# EAGLE board Arduino-M0-Pro-V4 (EAGLE 6.4)
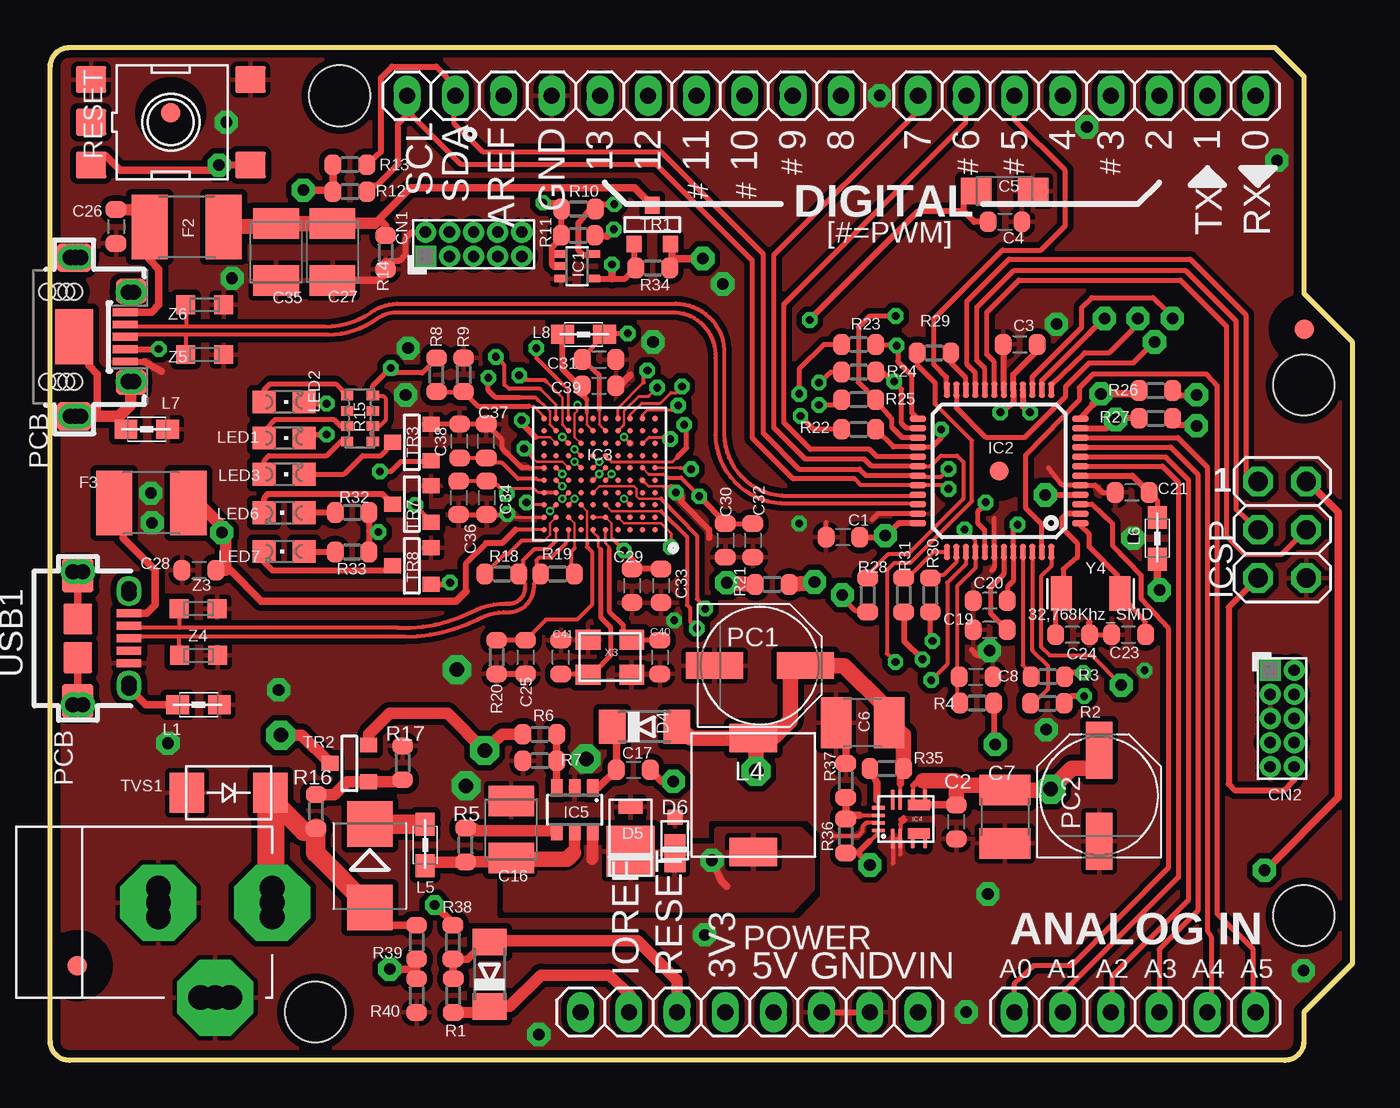
[diagram p3: board, top side]
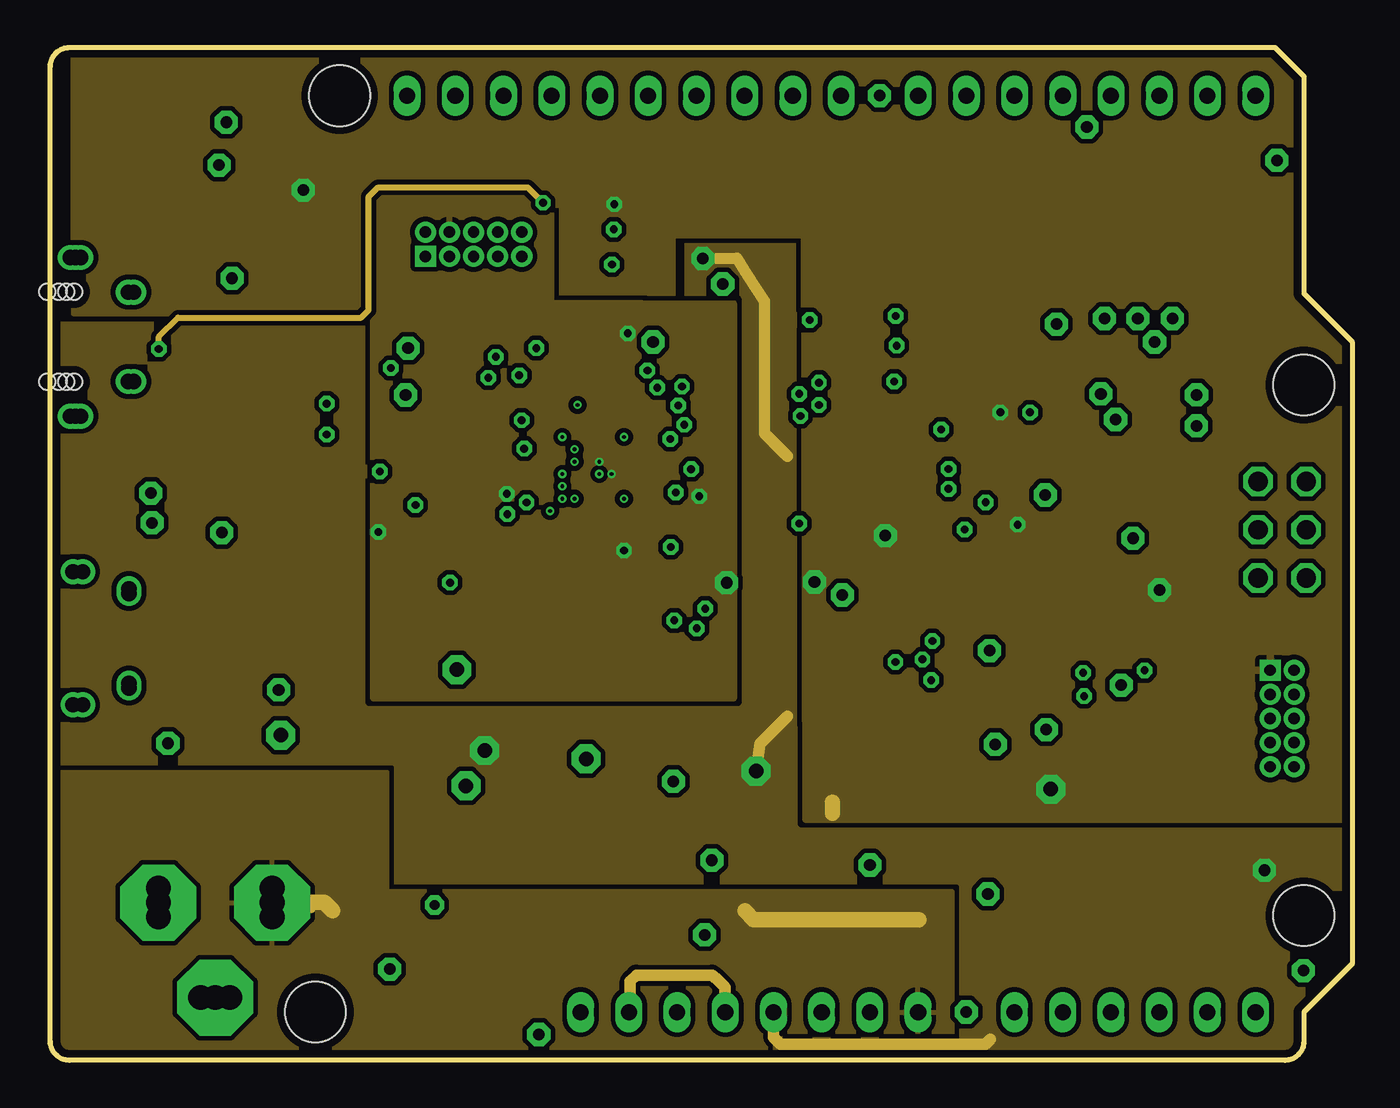
[diagram p4: board, inner layer Route2]
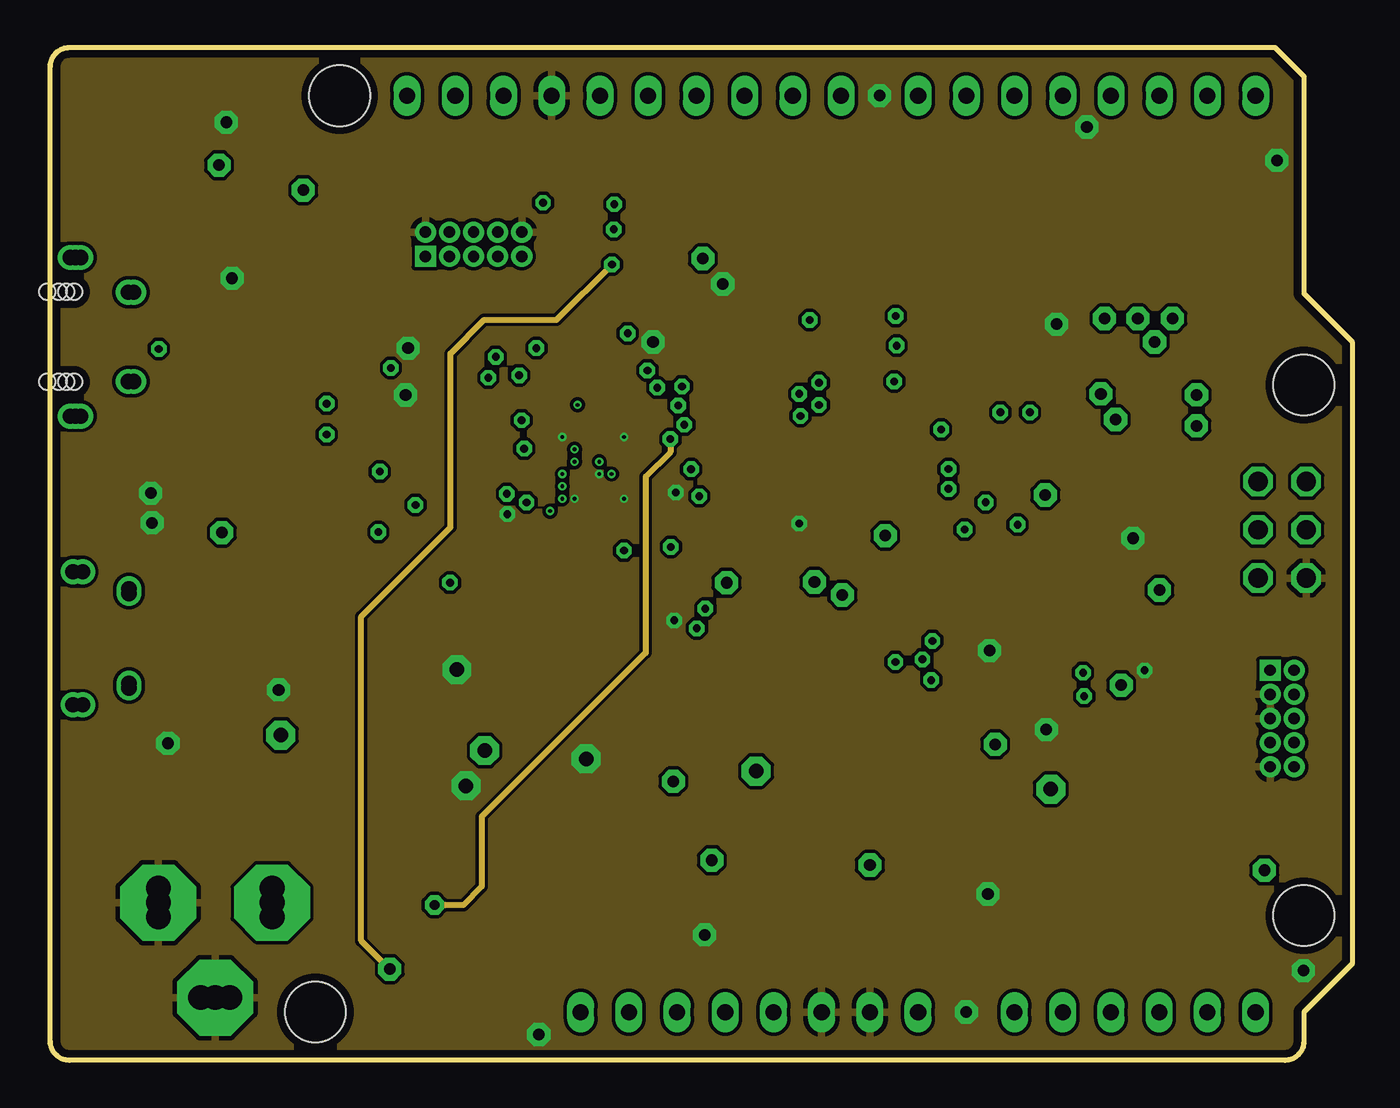
[diagram p5: board, inner layer Route15]
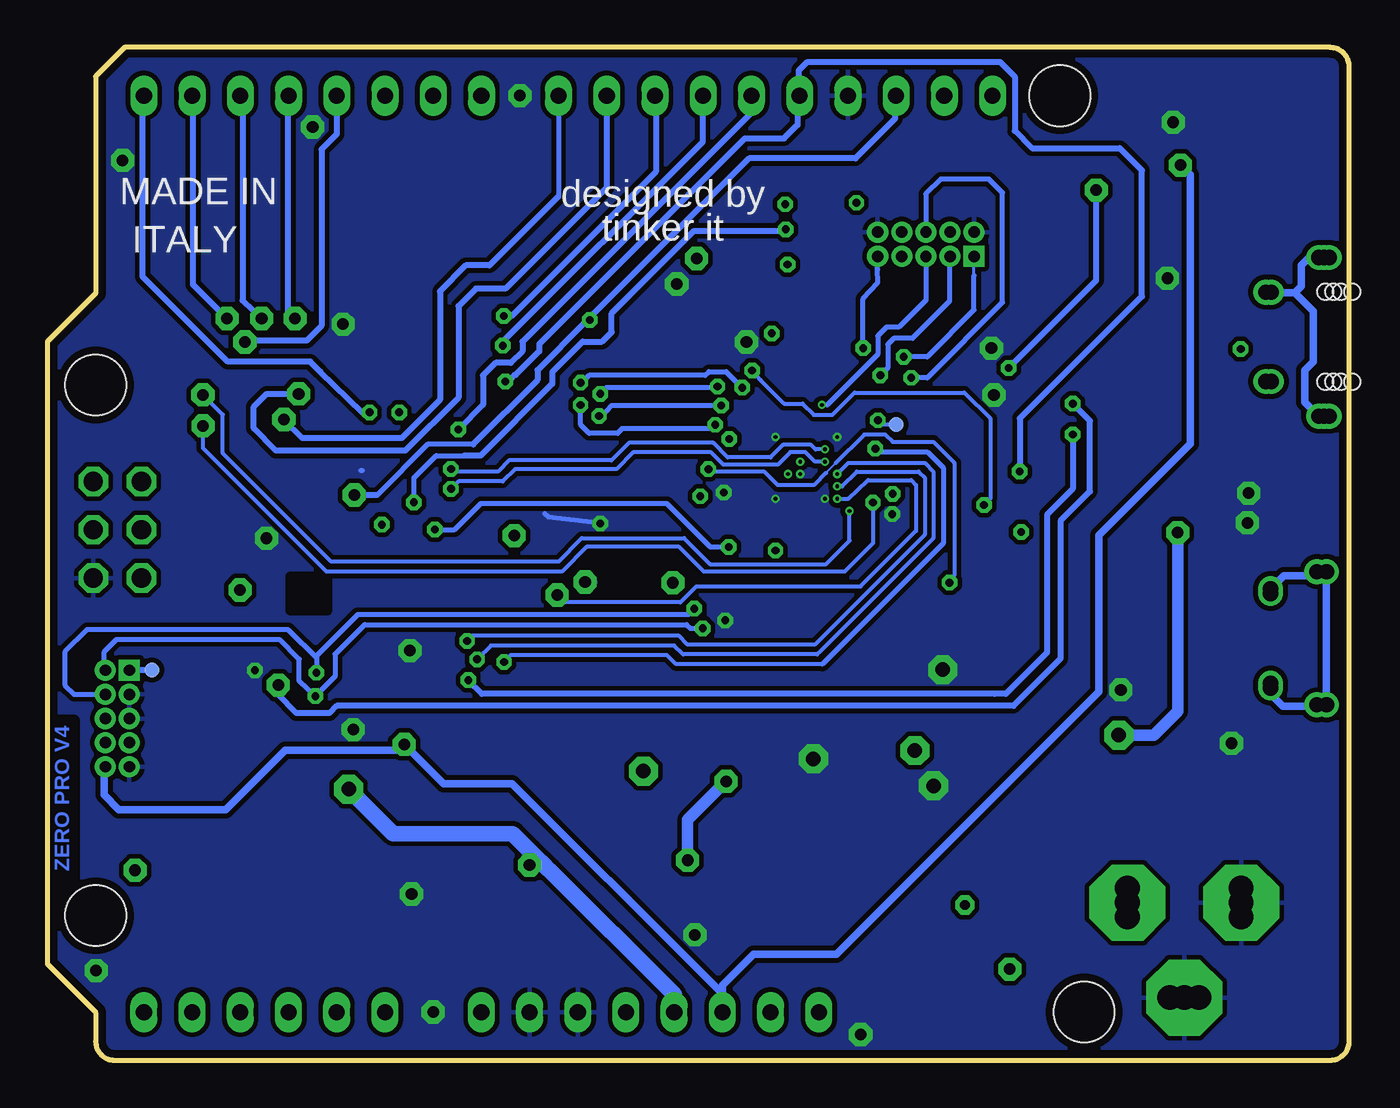
[diagram p6: board, bottom side, seen from below]

Size 68.58 x 53.34 mm. Coordinates in mm from the lower left corner, seen from the top.
Outline: 64.52,53.34 66.04,51.82 66.04,40.39 68.58,37.85 68.58,5.08 66.04,2.54 66.04,1 arc-90 65.04,0 1,0 arc-90 0,1 0,52.34 arc-90 1,53.34 64.52,53.34
Copper layers (1*2+15*16): Top 0.035mm / dielectric 0.5mm / Route2 0.035mm / dielectric 0.4mm / Route15 0.035mm / dielectric 0.5mm / Bottom 0.035mm
Design rules "ArduinoUno *": minimum track width 6mil, minimum drill 16mil, track to track 6mil, track to pad 6mil, pad to pad 6mil, via to via 6mil, smd to smd 4mil, copper to edge 16mil, drill to drill 10mil, minimum pad ring 10mil, minimum via ring 4.5mil, stop-mask expansion 1mil, vias tented up to drill 30mil, thermal gap 10mil
Net classes: 0 default: width 0.203 mm, drill 0.203 mm, clearance 0.178 mm; 1 USB: width 0.203 mm, drill 0.305 mm, clearance 0.178 mm; 2 gnd: width 0.254 mm, drill 0.254 mm, clearance 0.178 mm; 3 usbvcc: width 0.203 mm, drill 0.406 mm, clearance 0.178 mm; 4 USBpair: width 0.254 mm, drill 0.406 mm, clearance 0.508 mm to class 0, clearance 0.508 mm to class 1, clearance 0.508 mm to class 2, clearance 0.508 mm to class 3
Holes 3.2 mm at 66.04,35.56 66.04,7.62 15.24,50.8 13.97,2.54
bKeepout: area -0.1,3.2 to 1.9,11
bRestrict: 2 lines
vRestrict: area 22.9,44.1 to 24.6,49.1; area 25.4,45.5 to 27.1,49.1; area 28.4,45.3 to 29.6,48.8; area 31,45.3 to 32.1,48.8; area 33.5,45.3 to 34.7,48.8; area 36.1,45.3 to 37.2,48.8; area 38.7,47.2 to 39.9,48.8; area 40.3,45.1 to 47.6,46.9; area 60.3,44.2 to 61.7,46.7; area 62.9,44.2 to 64.3,46.7; area 61.3,35.8 to 64.8,37.2; area 0.6,21.8 to 2,30.1; area 5.7,22.6 to 7.4,30.1; area 47.9,10.3 to 48.5,10.8; area 50.4,10.2 to 50.9,11; area 11.3,28.8 to 12.7,31.1; area 44.8,47.5 to 46.1,48.9; area 47.6,47.4 to 48.8,48.9; area 50.2,47.4 to 51.3,48.9; area 52.8,47.4 to 54,48.9; area 55.2,47.4 to 56.4,48.9; area 57.9,47.4 to 59.1,48.9; area 60.5,47.4 to 61.6,48.9; area 63,47.4 to 64.1,48.9; area 41.3,47.2 to 42.4,48.8; area 0.3,12.4 to 9.4,24.5

## Footprints (pad centres in the part's own frame; a part is rotated, then mirrored left to right if it is on the bottom)
1X06 = drill 0.85 pad 1.422 long: 1 -6.35,0; 2 -3.81,0; 3 -1.27,0; 4 1.27,0; 5 3.81,0; 6 6.35,0
C0603-ROUND = smd 0.898 x 1.1: 1 -0.889,0; 2 0.889,0
SMC_A = smd 1.6 x 1.4: + -1.5,0; - 1.5,0
C1210 = smd 1.6 x 2.7: 1 -1.4,0; 2 1.4,0
SMC_B = smd 1.6 x 2.4: + -1.5,0; - 1.5,0
PINHEAD_2X05_127 = drill 0.6 pad 1.016 square: 1 -0.635,2.54 | drill 0.6 pad 1.016: 2 0.635,2.54; 3 -0.635,1.27; 4 0.635,1.27; 5 -0.635,0; 6 0.635,0; 7 -0.635,-1.27; 8 0.635,-1.27; 9 -0.635,-2.54; 10 0.635,-2.54
SMB = smd 2.4 x 2.4: A 2.2,0; C -2.2,0
MINIMELF = smd 1.4 x 1.8: A 1.7,0; C -1.7,0
DO220AAL = smd 2.667 x 2.54: P$1 -0.7,0 | smd 0.762 x 1.27: P$2 1.65,0
MICROSMP = smd 0.8 x 0.8: A 1.2,0 | smd 2 x 1.1: K -0.7,0
L1812 = smd 1.9 x 3.4: 1 -1.95,0; 2 1.95,0
FIDUCIA-MOUNT = smd 1.016 x 1.016: P$1 0,0
SC70-5 = smd 0.4 x 0.7: 1 -0.65,-0.85; 2 0,-0.85; 3 0.65,-0.85; 4 0.65,0.85; 5 -0.65,0.85
TQFP48-7X7 = smd 0.85 x 0.32: 1 -4.275,2.75; 2 -4.275,2.25; 3 -4.275,1.75; 4 -4.275,1.25; 5 -4.275,0.75; 6 -4.275,0.25; 7 -4.275,-0.25; 8 -4.275,-0.75; 9 -4.275,-1.25; 10 -4.275,-1.75; 11 -4.275,-2.25; 12 -4.275,-2.75; 25 4.275,-2.75; 26 4.275,-2.25; 27 4.275,-1.75; 28 4.275,-1.25; 29 4.275,-0.75; 30 4.275,-0.25; 31 4.275,0.25; 32 4.275,0.75; 33 4.275,1.25; 34 4.275,1.75; 35 4.275,2.25; 36 4.275,2.75 | smd 0.32 x 0.85: 13 -2.75,-4.275; 14 -2.25,-4.275; 15 -1.75,-4.275; 16 -1.25,-4.275; 17 -0.75,-4.275; 18 -0.25,-4.275; 19 0.25,-4.275; 20 0.75,-4.275; 21 1.25,-4.275; 22 1.75,-4.275; 23 2.25,-4.275; 24 2.75,-4.275; 37 2.75,4.275; 38 2.25,4.275; 39 1.75,4.275; 40 1.25,4.275; 41 0.75,4.275; 42 0.25,4.275; 43 -0.25,4.275; 44 -0.75,4.275; 45 -1.25,4.275; 46 -1.75,4.275; 47 -2.25,4.275; 48 -2.75,4.275 | smd 1 x 1: P$1 0,0
VFBGA100 = smd 0.28 x 0.28: A1 -2.925,2.925; A2 -2.275,2.925; A3 -1.625,2.925; A4 -0.975,2.925; A5 -0.325,2.925; A6 0.325,2.925; A7 0.975,2.925; A8 1.625,2.925; A9 2.275,2.925; A10 2.925,2.925; B1 -2.925,2.275; B2 -2.275,2.275; B3 -1.625,2.275; B4 -0.975,2.275; B5 -0.325,2.275; B6 0.325,2.275; B7 0.975,2.275; B8 1.625,2.275; B9 2.275,2.275; B10 2.925,2.275; C1 -2.925,1.625; C2 -2.275,1.625; C3 -1.625,1.625; C4 -0.975,1.625; C5 -0.325,1.625; C6 0.325,1.625; C7 0.975,1.625; C8 1.625,1.625; C9 2.275,1.625; C10 2.925,1.625; D1 -2.925,0.975; D2 -2.275,0.975; D3 -1.625,0.975; D4 -0.975,0.975; D5 -0.325,0.975; D6 0.325,0.975; D7 0.975,0.975; D8 1.625,0.975; D9 2.275,0.975; D10 2.925,0.975; E1 -2.925,0.325; E2 -2.275,0.325; E3 -1.625,0.325; E4 -0.975,0.325; E5 -0.325,0.325; E6 0.325,0.325; E7 0.975,0.325; E8 1.625,0.325; E9 2.275,0.325; E10 2.925,0.325; F1 -2.925,-0.325; F2 -2.275,-0.325; F3 -1.625,-0.325; F4 -0.975,-0.325; F5 -0.325,-0.325; F6 0.325,-0.325; F7 0.975,-0.325; F8 1.625,-0.325; F9 2.275,-0.325; F10 2.925,-0.325; G1 -2.925,-0.975; G2 -2.275,-0.975; G3 -1.625,-0.975; G4 -0.975,-0.975; G5 -0.325,-0.975; G6 0.325,-0.975; G7 0.975,-0.975; G8 1.625,-0.975; G9 2.275,-0.975; G10 2.925,-0.975; H1 -2.925,-1.625; H2 -2.275,-1.625; H3 -1.625,-1.625; H4 -0.975,-1.625; H5 -0.325,-1.625; H6 0.325,-1.625; H7 0.975,-1.625; H8 1.625,-1.625; H9 2.275,-1.625; H10 2.925,-1.625; J1 -2.925,-2.275; J2 -2.275,-2.275; J3 -1.625,-2.275; J4 -0.975,-2.275; J5 -0.325,-2.275; J6 0.325,-2.275; J7 0.975,-2.275; J8 1.625,-2.275; J9 2.275,-2.275; J10 2.925,-2.275; K1 -2.925,-2.925; K2 -2.275,-2.925; K3 -1.625,-2.925; K4 -0.975,-2.925; K5 -0.325,-2.925; K6 0.325,-2.925; K7 0.975,-2.925; K8 1.625,-2.925; K9 2.275,-2.925; K10 2.925,-2.925
QFN-12 = smd 1.05 x 0.2: 1 -1.025,0.7; 2 -1.025,0.3; 3 -1.025,-0.35; 4 -1.025,-1; 5 1.025,-1; 6 1.025,-0.35; 7 1.025,0.3; 8 1.025,0.7 | smd 0.2 x 0.7: 9 0.6,1.45; 10 0.2,1.45; 11 -0.2,1.45; 12 -0.6,1.45 | smd 0.55 x 1.2: 13 -0.75,-0.675; 14 0.75,-0.675
SOT23-6 = smd 0.6 x 0.9: 1 -0.95,-1.15; 2 0,-1.15; 3 0.95,-1.15; 4 0.95,1.15; 5 0,1.15; 6 -0.95,1.15
2X03 = drill 1.016 pad 1.55 octagon: 1 -2.54,-1.27; 2 -2.54,1.27; 3 0,-1.27; 4 0,1.27; 5 2.54,-1.27; 6 2.54,1.27
1X10 = drill 0.85 pad 1.422 long: 1 -11.43,0; 2 -8.89,0; 3 -6.35,0; 4 -3.81,0; 5 -1.27,0; 6 1.27,0; 7 3.81,0; 8 6.35,0; 9 8.89,0; 10 11.43,0
1X08 = drill 0.85 pad 1.422 long: 1 -8.89,0; 2 -6.35,0; 3 -3.81,0; 4 -1.27,0; 5 1.27,0; 6 3.81,0; 7 6.35,0; 8 8.89,0
0805 = smd 1.2 x 1: 1 -1.1,0; 2 1.1,0
SRR0604 = smd 1.5 x 2.5: P$1 3,0; P$2 -3,0
CHIPLED_0805 = smd 1.2 x 1.2: A 0,-1.05; C 0,1.05
PANASONIC_D = smd 3 x 1.4: + 2.4,0; - -2.4,0
R0603-ROUND = smd 0.898 x 1.1: 1 -0.889,0; 2 0.889,0
CAY16 = smd 0.5 x 0.65: 1 -1.2,-0.675; 2 -0.4,-0.675; 3 0.4,-0.675; 4 1.2,-0.675; 5 1.2,0.675; 6 0.4,0.675; 7 -0.4,0.675; 8 -1.2,0.675
TS42 = smd 1.6 x 1.4: 1 -4.2,2.25; 2 4.2,2.25; 3 -4.2,-2.25; 4 4.2,-2.25; 5 -4.2,0
TP-SP = smd 0.8 x 0.8 bottom: X 0,0
SOT-23 = smd 0.787 x 0.889: 1 0.025,-1.016; 2 -0.94,1.016; 3 0.991,1.016
SMA-TVS = smd 1.8 x 2.1: A -2.2,0; K 2.2,0
CON2_USB_MICRO_B_AT = smd 0.406 x 1.346: P1 -1.321,2.692; P2 -0.66,2.692; P3 0,2.692; P4 0.66,2.692; P5 1.321,2.692 | drill 0.8 pad 1.24: P$1 -2.616,2.692; P$2 -2.362,2.692; P$7 2.362,2.692; P$8 2.616,2.692 | drill 0.8 pad 1.25: P$3 -3.505,-0.254; P$4 -3.505,0.254; P$5 3.505,0.254; P$6 3.505,-0.254 | smd 1.778 x 1.651: S1 -3.302,0; S2 3.302,0 | smd 1.524 x 1.27: S3 -2.489,2.692; S4 2.489,2.692 | smd 1.626 x 1.524: S5 -1.016,0; S6 1.016,0
MCR-AB1-S-RA-SMT = smd 0.4 x 1.35: 1 -1.3,2.7; 2 -0.65,2.7; 3 0,2.7; 4 0.65,2.7; 5 1.3,2.7 | drill 0.8: P$1 -4.175,0.356; P$3 -4.175,0.076; P$4 -4.175,-0.203; P$5 4.175,0.356; P$6 4.175,0.076; P$7 4.175,-0.203 | smd 2.9 x 2: P$2 0,0 | drill 0.8 pad 1.27: P$8 -2.35,3.15; P$9 -2.35,2.85; P$10 2.35,3.15; P$11 2.35,2.85 | smd 1.3 x 1.6: S1 -2.4,3; S2 2.4,3 | smd 1.5 x 1.8: S3 -4.175,0; S4 4.175,0 | hole 0.85: -2.375,0; 2.375,0; -2.375,-1.4; 2.375,-1.4; -2.375,-0.4; 2.375,-0.4; 2.375,-0.8; -2.375,-0.8
POWERSUPPLY_DC-21MM = drill 1.3 pad 4 octagon: 1 -5.08,-3.353; 2 -0.076,-6.35; 3 -0.076,-0.356 | drill 1.3: 4 -5.08,-4.115; 5 -5.08,-2.591; 6 -0.838,-0.356; 7 0.686,-0.356; 8 -0.838,-6.35; 9 0.686,-6.35
CRYSTAL-3.2-2.5 = smd 1.3 x 1.05: 1 -1.15,-0.925; 2 1.15,-0.925; 3 1.15,0.925; 4 -1.15,0.925
RESONATOR_EPSON_FC_145 = smd 1.1 x 1.8: P$1 -1.55,0; P$2 1.55,0
CT/CN0603 = smd 1 x 1: 1 -1,0; 2 1,0

## Placement (x,y rotation side)
AD  FH254-106DF08500V  [1X06]  57.15,2.54 0 top
C1  100nF  [C0603-ROUND]  41.76,27.55 180 top
C2  100n  [C0603-ROUND]  47.73,12.55 90 top
C3  100nF  [C0603-ROUND]  51.09,37.7 0 top
C4  100nF  [C0603-ROUND]  50.3,44.16 0 top
C5  4u7  [SMC_A]  50.27,45.78 0 top
C6  10uF_35V  [C1210]  42.8,17.78 180 top
C7  10uF_35V  [C1210]  50.29,12.83 270 top
C8  10nF  [C0603-ROUND]  48.77,20.19 0 top
C16  22u  [SMC_B]  24.28,12.16 90 top
C17  10n  [C0603-ROUND]  30.71,15.3 0 top
C19  100nF  [C0603-ROUND]  49.51,22.67 180 top
C20  100nF  [C0603-ROUND]  49.51,24.2 180 top
C21  100nF  [C0603-ROUND]  56.99,29.91 180 top
C23  22p  [C0603-ROUND]  56.81,22.42 0 top
C24  22p  [C0603-ROUND]  53.85,22.41 180 top
C25  10pF  [C0603-ROUND]  25.04,21.23 270 top
C26  10n  [C0603-ROUND]  3.46,43.91 270 top
C27  22u  [SMC_B]  14.87,42.57 270 top
C28  100n  [C0603-ROUND]  7.83,25.81 180 top
C29  100nF  [C0603-ROUND]  30.65,24.99 270 top
C30  100nF  [C0603-ROUND]  35.56,27.38 270 top
C31  100nF  [C0603-ROUND]  28.91,36.9 0 top
C32  1uF  [C0603-ROUND]  37.01,27.38 270 top
C33  1uF  [C0603-ROUND]  32.17,24.99 270 top
C34  1uF  [C0603-ROUND]  22.98,29.62 270 top
C35  22u  [SMC_B]  11.9,42.56 270 top
C36  100nF  [C0603-ROUND]  21.51,29.62 270 top
C37  1nF  [C0603-ROUND]  22.97,32.61 90 top
C38  1uF  [C0603-ROUND]  21.56,32.61 90 top
C39  100nF  [C0603-ROUND]  28.91,35.52 0 top
C40  10pF  [C0603-ROUND]  32.11,21.23 270 top
C41  10pF  [C0603-ROUND]  26.9,21.23 90 top
CN1  PINHEAD-2x5-P1.27  [PINHEAD_2X05_127]  22.3,42.98 90 top
CN2  PINHEAD-2x5-P1.27  [PINHEAD_2X05_127]  64.9,18 0 top
D1  M7  [SMB]  16.83,10.24 270 top
D2  CD1206-S01575  [MINIMELF]  23.14,4.54 90 top
D4  CD1206-S01575  [MINIMELF]  31.31,17.57 0 top
D5  SS1P3L  [DO220AAL]  30.56,11.71 90 top
D6  MSS1P3L-M3/89A  [MICROSMP]  32.9,11.6 90 top
F2  MF-MSMF050-2 500mA  [L1812]  7.19,43.89 180 top
F3  MF-MSMF050-2 500mA  [L1812]  5.33,29.36 180 top
FD1  FIDUCIALMOUNT  [FIDUCIA-MOUNT]  6.35,49.91 0 top
FD2  FIDUCIALMOUNT  [FIDUCIA-MOUNT]  1.42,4.98 0 top
FD3  FIDUCIALMOUNT  [FIDUCIA-MOUNT]  66.06,38.51 0 top
IC1  74LVC1G125DCKR  [SC70-5]  27.76,41.82 270 top
IC2  SAMD21G18A-AUT  [TQFP48-7X7]  49.99,31.04 180 top
IC3  [VFBGA100]  28.93,30.88 180 top
IC4  MPM3810GQB-33  [QFN-12]  45.09,12.7 90 top
IC5  LM2734Y  [SOT23-6]  27.63,13.19 180 top
ICSP  3x2 M  [2X03]  64.9,27.94 270 top
IOH  FH254-110DF08500V  [1X10]  30.23,50.8 180 top
IOL  FH254-108DF08500V  [1X08]  54.61,50.8 180 top
L1  MH2029-300Y  [0805]  7.81,18.72 0 top
L4  10uH-SRR0604-100ML  [SRR0604]  37.03,13.97 270 top
L5  MH2029-300Y  [0805]  19.75,11.34 270 top
L6  MH2029-300Y  [0805]  58.32,27.48 270 top
L7  MH2029-300Y  [0805]  5.08,33.23 0 top
L8  MH2029-300Y  [0805]  28.09,38.23 180 top
LED1  Yellow  [CHIPLED_0805]  12.32,32.77 270 top
LED2  Yellow  [CHIPLED_0805]  12.32,34.67 270 top
LED3  Yellow  [CHIPLED_0805]  12.32,30.86 270 top
LED6  Green  [CHIPLED_0805]  12.32,28.83 90 top
LED7  Green  [CHIPLED_0805]  12.32,26.8 90 top
PC1  47u  [PANASONIC_D]  37.38,20.79 0 top
PC2  47u  [PANASONIC_D]  55.26,13.93 90 top
POWER  FH254-108DF08500V  [1X08]  36.83,2.54 0 top
R1  10k  [R0603-ROUND]  21.23,3.41 270 top
R2  0R  [R0603-ROUND]  52.53,18.8 180 top
R3  0R  [R0603-ROUND]  52.55,20.21 0 top
R4  330R  [R0603-ROUND]  48.81,18.81 0 top
R5  52K3  [R0603-ROUND]  21.87,11.34 90 top
R6  52K3  [R0603-ROUND]  25.79,17.17 0 top
R7  10k 1%  [R0603-ROUND]  25.79,15.78 180 top
R8  52k3  [R0603-ROUND]  20.35,36.1 90 top
R9  52k3  [R0603-ROUND]  21.77,36.1 270 top
R10  100K_1%  [R0603-ROUND]  27.82,44.84 0 top
R11  330R  [R0603-ROUND]  27.81,43.45 0 top
R12  10k  [R0603-ROUND]  15.79,45.75 180 top
R13  10k  [R0603-ROUND]  15.78,47.16 180 top
R14  10K  [R0603-ROUND]  17.67,42.54 90 top
R15  470R_064R  [CAY16]  16.32,33.8 270 top
R16  52K3  [R0603-ROUND]  14,13.11 270 top
R17  52K3  [R0603-ROUND]  18.56,15.66 270 top
R18  39R  [R0603-ROUND]  23.79,25.61 180 top
R19  39R  [R0603-ROUND]  26.72,25.61 0 top
R20  6K8  [R0603-ROUND]  23.52,21.23 90 top
R21  0R  [R0603-ROUND]  38.03,25.06 180 top
R22  330R  [R0603-ROUND]  42.59,33.23 0 top
R23  330R  [R0603-ROUND]  42.59,37.7 0 top
R24  330R  [R0603-ROUND]  42.59,36.24 0 top
R25  330R  [R0603-ROUND]  42.59,34.79 0 top
R26  330R  [R0603-ROUND]  58.24,35.27 0 top
R27  330R  [R0603-ROUND]  58.24,33.81 0 top
R28  330R  [R0603-ROUND]  43.06,24.5 270 top
R29  330R  [R0603-ROUND]  46.56,37.26 180 top
R30  330R  [R0603-ROUND]  46.37,24.5 270 top
R31  330R  [R0603-ROUND]  44.96,24.5 270 top
R32  330R  [R0603-ROUND]  15.9,28.85 0 top
R33  330R  [R0603-ROUND]  15.9,26.77 0 top
R34  52K3  [R0603-ROUND]  31.74,41.73 0 top
R35  0R  [R0603-ROUND]  44.07,15.37 0 top
R36  100K_1%  [R0603-ROUND]  41.91,11.81 270 top
R37  22K  [R0603-ROUND]  41.91,14.73 270 top
R38  330R  [R0603-ROUND]  21.21,6.22 270 top
R39  100K_1%  [R0603-ROUND]  19.3,6.22 90 top
R40  47K_1%  [R0603-ROUND]  19.3,3.41 90 top
RESET  TS42031-160R-TR-7260  [TS42]  6.35,49.4 0 top
TP_0  TP_SP  [TP-SP]  63.5,50.8 0 top
TP_1  TP_SP  [TP-SP]  60.96,50.8 0 top
TP_2  TP_SP  [TP-SP]  58.42,50.8 0 top
TP_3  TP_SP  [TP-SP]  55.88,50.8 0 top
TP_3V3  TP_SP  [TP-SP]  35.56,2.54 0 top
TP_3V31  TP_SP  [TP-SP]  63.09,20.55 0 top
TP_4  TP_SP  [TP-SP]  53.34,50.8 0 top
TP_5  TP_SP  [TP-SP]  50.8,50.8 0 top
TP_5V  TP_SP  [TP-SP]  38.1,2.54 0 top
TP_6  TP_SP  [TP-SP]  48.26,50.8 0 top
TP_7  TP_SP  [TP-SP]  45.72,50.8 0 top
TP_8  TP_SP  [TP-SP]  41.66,50.8 0 top
TP_9  TP_SP  [TP-SP]  39.12,50.8 0 top
TP_10  TP_SP  [TP-SP]  36.58,50.8 0 top
TP_12  TP_SP  [TP-SP]  31.5,50.8 0 top
TP_A0  TP_SP  [TP-SP]  50.8,2.54 0 top
TP_A1  TP_SP  [TP-SP]  53.34,2.54 0 top
TP_A2  TP_SP  [TP-SP]  55.88,2.54 0 top
TP_A3  TP_SP  [TP-SP]  58.42,2.54 0 top
TP_A4  TP_SP  [TP-SP]  60.96,2.54 0 top
TP_A5  TP_SP  [TP-SP]  63.5,2.54 0 top
TP_AREF  TP_SP  [TP-SP]  23.88,50.8 0 top
TP_EDBG_FORCE_BOOT  TP_SP  [TP-SP]  23.88,33.49 0 top
TP_GND  TP_SP  [TP-SP]  26.41,50.8 0 top
TP_MOSI  TP_SP  [TP-SP]  34.04,50.8 0 top
TP_PWRIN  TP_SP  [TP-SP]  13.21,8.26 0 top
TP_RESET  TP_SP  [TP-SP]  33.02,2.54 0 top
TP_SCK  TP_SP  [TP-SP]  28.96,50.8 0 top
TP_SCL  TP_SP  [TP-SP]  18.8,50.8 0 top
TP_SDA  TP_SP  [TP-SP]  21.34,50.8 0 top
TR1  PMV48XP  [SOT-23]  31.74,44.01 180 top
TR2  PMV48XP  [SOT-23]  15.76,15.66 270 top
TR3  2N7002  [SOT-23]  19.05,32.56 270 top
TR7  2N7002  [SOT-23]  19.05,29.32 270 top
TR8  2N7002  [SOT-23]  19.05,26.07 270 top
TVS1  SMAJ12CA  [SMA-TVS]  9.4,14.1 0 top
U$1  DISCLAIMER  [DISCLAIMER]  -9.02,-25.78 0 top  (outside the outline)
U$2  DISCLAIMER  [DISCLAIMER]  -9.53,-46.74 0 top  (outside the outline)
U$3  DISCLAIMER  [DISCLAIMER]  -10.03,-67.69 0 top  (outside the outline)
USB1  MCR-B-S-RA-SMT-CS1TR  [CON2_USB_MICRO_B_AT]  1.45,22.23 270 top
USB2  MCR-AB1-S-RA-SMT-TR  [MCR-AB1-S-RA-SMT]  1.25,38.1 270 top
X1  POWER-SUPPLY  [POWERSUPPLY_DC-21MM]  5.33,8.38 90 top
X3  12mHz-12pF-K7  [CRYSTAL-3.2-2.5]  29.48,21.23 0 top
Y4  32,768Khz_SMD  [RESONATOR_EPSON_FC_145]  54.81,24.58 0 top
Z3  BRNCG0603MLC-05E  [CT/CN0603]  7.8,23.79 180 top
Z4  BRNCG0603MLC-05E  [CT/CN0603]  7.81,21.32 180 top
Z5  BRNCG0603MLC-05E  [CT/CN0603]  8.13,37.17 0 top
Z6  BRNCG0603MLC-05E  [CT/CN0603]  8.13,39.79 0 top

## Tracks (layer width: path | path; a pad name or v marks a point on that pad's centre or on a via)
+3V3  (via drill 0.41, 0.61, 0.76)
  Top 0.203: R15.5 R15.6 17.34,33.4 17.68,33.73 17.68,34.84 17.55,34.97 17.02,34.97 R15.8 | 45.47,14.48 45.44,14.45 IC4.6 | IC4.5 46.09,14.72 46.23,14.73 | IC4.12 43.59,12.07 43.59,11.94 43.2,11.56 43.18,11.56
  Top 0.254: v50.96,28.21 50.74,27.98 IC2.44 50.74,25.25 50.42,24.94 50.42,24.23 C20.1 | R8.2 19.6,36.2 18.14,36.2 | R15.8 16.99,35.52 v17.94,36.47
  Top 0.305: IC2.36 44.68,28.28 44.23,27.88 44.11,27.76 v43.99,27.63 43.91,27.55 C1.1 | 17.94,36.34 18.14,36.2 | v50.05,34.12 50.74,34.61 IC2.17 50.74,36.11 51.98,37.35 C3.2 | IC1.5 28.6,42.42 28.07,42.42 27.81,42.67 27.81,44.07 28.41,44.79 | 28.41,44.79 arc-90 28.7,45.09 v29.72,45.09 | 28.41,44.79 R10.2 | 45.97,14.73 45.72,14.73 45.47,14.48 | 43.18,11.56 42.55,10.92 | 42.55,10.92 R36.2 | 42.55,10.92 v43.18,10.29 | C2.2
  Top 0.406: 14.88,45.95 R12.2 | R13.2 14.89,45.94 R12.2 | 17.94,36.34 v17.94,36.47 | IC4.14 C2.2 | v13.32,45.83 14.81,45.83 R12.2 | L6.2 58.32,24.88 v58.44,24.77
  Top 0.61: POWER.2 30.55,2.61 30.55,3.44 29.45,4.49 25.85,4.49 24.21,2.85 D2.C 22.79,2.51 R1.2
  Top 0.813: R21.1 40.06,25.12 v40.26,25.19 | PC2.+ 55.26,15.38 53.82,15.38 v52.71,14.28 52.66,14.23 C7.1 49.93,14.59 49.83,14.48 47.88,14.48 | 45.97,14.73 46.23,14.73 47.62,14.73 47.88,14.48 | C2.2 47.73,14.33 47.88,14.48
  Route2 0.61: POWER.2 30.55,2.61 30.55,4.16 30.88,4.49 34.85,4.49 35.11,4.28 35.55,3.83 TP_3V3.X
  Route2 0.813: 41.21,13 41.21,13.59
  Bottom 0.254: v50.96,28.21 51.02,28.14 | TP_3V3.X | 43.12,10.73 43.18,10.79 43.18,11.05
  Bottom 0.305: v43.99,27.63 43.99,27.57 44.04,27.43 | v17.94,36.47 13.32,41.08 v13.32,45.83 | TP_3V31.X CN2.1 | v43.18,10.29 42.93,10.29 42.67,10.54
  Bottom 0.813: v40.26,25.19 40.01,25.19 | 42.15,10.04 42.45,10.34 42.47,10.34 42.61,10.48 | 42.15,10.04 35.55,3.44 TP_3V3.X | v52.71,14.28 50.37,11.94 44.07,11.94 43.18,11.05 42.67,10.54 42.17,10.04 42.15,10.04
  pour Route2 (isolate 0.254, rank 2): 76.2,54.53 1.27,54.53 1.27,39.37 32.77,39.37 32.77,43.48 39.74,43.48 39.8,12.7 76.2,12.7
+5V  (via drill 0.61, 0.76)
  Top 0.203: IC4.7 44.78,14.56
  Top 0.406: ICSP.2 66.24,30.48 67.86,28.86 67.86,13.85 64.03,10.01 v63.96,10.01 | R34.2 32.63,41.79 32.76,41.92 32.76,42.25 | 32.76,42.25 32.76,42.91 TR1.2 | v34.38,42.22 32.79,42.22 32.76,42.25 | 44.78,14.56 44.78,15.16 R35.2
  Top 0.61: R6.1 23.8,17.17 v22.88,16.32 20.93,18.27 17.88,18.27 16.77,17.16 16.77,16.61 TR2.2
  Top 0.813: v37.18,15.23 37.18,16.97 L4.P$2 36.45,16.97 | 36.45,16.97 33.76,16.97 D4.A | R35.2 44.96,17.15 C6.1 43.94,18.16 43.94,18.67 41.82,20.79 PC1.+ 39.08,20.79 38.99,20.7 38.99,17.91 38.1,17.02 36.5,17.02 36.45,16.97
  Route2 0.61: 38.85,31.81 37.63,33.02 37.63,39.98 36.73,41.34 36.17,42.25 v34.38,42.22 | 38.85,18.12 37.39,16.66 v37.18,15.23 | TP_5V.X 38.1,1.23 38.48,0.84 49.27,0.84 49.53,1.1
  Bottom 0.305: TP_5V.X
  pour Route2 (isolate 0.254, rank 4): -3.13,38.61 33.69,38.61 33.69,43.86 40.21,43.86 40.21,38.64 70.5,38.64 71.02,-1.57 -2.61,-1.57
BD+
  Top 0.127: 27.17,27.23 27.3,27.36 IC3.A8
  Top 0.203: IC3.A8 27.31,27.9 | 6.79,22.32 18.67,22.32 arc26 22.49,23.2 arc-33 24.11,23.59 arc88 25.48,24.89 25.48,25.09 25.83,25.5 R19.1 25.61,25.83 25.61,26.32 25.74,26.45 26.39,26.45 27.17,27.23 | 6.79,22.32 4.79,22.32 4.7,22.23 USB1.P3 | Z4.2 6.79,21.89 6.79,22.32
BD-
  Top 0.127: IC3.A9 26.65,27.36
  Top 0.203: 6.79,22.77 18.32,22.77 arc28 22.16,23.59 arc-29 23.98,24.05 arc0 24.05,24.05 arc94 25.02,24.89 25.02,25.09 24.68,25.44 R18.1 24.89,25.83 24.89,26.32 25.48,26.91 26.2,26.91 26.65,27.36 | 6.79,22.77 4.75,22.77 USB1.P2 | Z3.2 6.79,23.5 6.79,22.77
BOOST
  Top 0.406: IC5.1 28.87,14.34 C17.1 29.84,17.19 D4.C
DGI_GPIO0
  Top 0.254: IC2.22 48.24,35.94 47.45,36.73 R29.1
DGI_GPIO1
  Top 0.203: IC2.30 46.37,31.29 46.93,31.85 47.77,31.85 48.1,31.52 48.1,29.57 45.17,26.65 44.13,26.65 43.06,25.58 R28.1
  Top 0.254: TP_7.X 45.63,50.71 45.62,50.24 45.62,49.91 38.12,42.41 38.12,33.31 39.78,31.66 42.9,31.66 43.27,31.29 IC2.30
DGI_GPIO2  (via drill 0.61 pad 0.41)
  Top 0.305: R27.1 56.19,33.81 v56.12,33.74 55.67,33.29 IC2.11
  Bottom 0.254: TP_8.X 41.66,45.49
  Bottom 0.305: 41.66,45.49 45.3,41.86 46.54,41.86 47.91,40.49 47.91,34.77 49.92,32.76 55.14,32.76 v56.12,33.74 56.06,33.81
DGI_GPIO3  (via drill 0.61 pad 0.41)
  Top 0.305: IC2.12 54.26,33.82 54.92,34.55
  Top 0.406: 54.92,34.55 55.34,34.97 v55.34,35.1 57.1,35.1 R26.1
  Bottom 0.254: TP_9.X 39.13,50.79
  Bottom 0.305: 39.13,50.79 39.13,45.96 44.45,40.64 46.01,40.64 46.93,39.72 46.93,34.91 49.73,32.11 56.55,32.11 57.71,33.27 57.71,34.41 57.02,35.1 v55.34,35.1
EDBG_ADC0
  Top 0.152: 25.22,34.45 25.48,34.45 26,33.87 IC3.K10
  Top 0.254: 25.22,34.45 22.52,34.45 R9.2 20.37,35.2 R8.1
EDBG_FORCE_BOOT  (via drill 0.41)
  Top 0.127: IC3.H9 26.32,32.83 25.56,32.83
  Top 0.305: v24.83,33.71 24.83,33.56 25.56,32.83
  Bottom 0.203: v24.83,33.71 24.61,33.49 TP_EDBG_FORCE_BOOT.X
EN
  Top 0.61: R5.2 22.29,12.23 22.43,12.09 26.63,12.09 IC5.4
FB
  Top 0.406: IC5.3 26.68,15.91 R7.1 R6.2
GND  (via drill 0.2, 0.2 pad 0.41, 0.41, 0.61, 0.76)
  Top 0.127: IC3.E6 v28.93,30.88 IC3.F5 | IC3.C3 v30.23,29.57 | 31.52,30.23 32.3,30.23
  Top 0.152: IC3.H8 v26.98,32.83 | IC3.H3 v30.23,32.83 | IC3.F10 25.22,31.2 | IC3.E2 31.52,30.23 | 32.3,30.23 32.7,30.23 | 24.5,28.6 IC3.B10 | IC3.C8 v27.62,29.57 | 29.8,36.69 29.96,36.85
  Top 0.203: 43,12.5 IC4.11 42.98,12.5 42.8,12.32 42.8,12.06 42.55,11.81 41.27,11.81 | 44.38,10.35 IC4.1 44.7,11.68 44.73,11.66 IC4.2 44.78,10.85 | 44.78,12.42 44.78,12.12 | 44.78,12.42 45.03,12.65 | 44.78,12.42 44.78,12.68 44.96,12.8
  Top 0.254: C24.1 55,22.41 C23.1 | 20.12,33.5 C38.2 C37.2 23.79,32.68 23.79,32.24 24.83,31.2 25.22,31.2 | C36.2 C34.2 23.98,28.73 v24.08,28.76 | 49.74,28.52 IC2.42 49.74,25.95 49.59,25.8 | C1.2 40.87,28.32 | IC2.35 43.61,28.79 43.29,28.47 | C21.2 55.45,29.9 55.06,30.29 IC2.5 53.3,30.29 52.59,31.2 | IC2.18 | 32.7,30.23 33.02,29.9 v32.96,29.9 | 29.96,36.85 29.95,36.84 C31.2
  Top 0.305: POWER.6 POWER.7 | R14.1 17.69,42.12 18.39,42.12 18.72,42.45 18.72,43.29 19.04,43.61 CN1.2 | R20.1 C25.2 | 48.56,21.61 48.8,21.37 49.44,21.24 | C24.1 54.74,23.09 | v32.96,29.9 33.22,29.77 33.22,29.45 34.71,27.95 34.71,27.5 | IC2.18 50.24,37.56 50.24,37.31 | USB2.5 4.95,36.8
  Top 0.406: C27.- 17.28,41.07 17.61,41.41 17.61,42.04 R14.1 | C39.2 29.93,35.46 30.55,36.08 | 4.95,36.8 5.85,36.28 | 41.91,16.76 41.91,15.82
  Top 0.61: 15.64,41.06 C27.-
  Bottom 0.127: v30.23,29.57 30.23,29.38
  Bottom 0.254: v39.45,28.27 42.19,28.6 42.38,28.79 | 52.06,31.07 52,31.07
  Bottom 0.406: v18.85,37.51 18.79,37.44 18.91,37.31
  other vias: 34.47,6.6 6.2,16.7 54.61,49.15 21.89,14.46 43.69,50.8 48.26,2.54 25.74,1.36 66.01,4.72 64.62,47.4 9.27,49.4 12.03,19.51 35.42,40.88 18.72,35.03 53.01,38.77 57.04,27.5 21.42,20.58 57.66,20.54 52.47,17.41 5.36,28.31 31.75,37.83 49.39,8.76 49.48,21.57 28.24,15.88 5.3,29.87 32.88,23.17 9.58,41.19
  pour Bottom (isolate 0.254, rank 2): -9.18,55.88 71.12,55.88 71.12,-1.27 -9.51,-1.27
  pour Top (isolate 0.305, rank 2): -5.08,54.46 70.16,55.24 69.89,-2.54 -5.08,-2.54
  pour Route15: -5.13,-5.72 77.16,-5.72 77.16,56.23 77.16,56.74 -5.13,56.74 -5.13,56.55
MISO  (via drill 0.41)
  Top 0.254: 43.27,33.23 R22.2 44.41,32.3 45.73,32.3 | IC2.28 45.73,32.3 | 45.73,32.3 46.48,32.3 46.93,32.76 v46.93,33.22
  Bottom 0.254: TP_12.X 31.48,50.81
  Bottom 0.305: 31.48,50.81 31.46,50.79 | v46.93,33.22 45.63,34.52 45.63,36.08 44.98,36.73 44.17,36.73 43.56,37.34 43.56,37.85 31.5,49.91 TP_12.X
MOSI  (via drill 0.41)
  Top 0.254: R23.2 44.4,37.7 v44.59,37.63 44.66,37.63 44.66,36.79 45.37,36.08 45.37,34.12 45.38,34.12 IC2.25 45.37,34.13
  Bottom 0.254: v44.59,37.63 44.59,37.7
  Bottom 0.305: TP_MOSI.X 34.06,50.78 34.06,48.35 34.2,48.23 44.59,37.83 v44.59,37.63 44.52,37.63
N$1
  Top 0.305: LED6.C 11.27,29.6 11.44,29.84 17.48,29.84 TR7.1
N$2
  Top 0.305: LED7.C 11.27,26.24 11.7,25.8 17.79,25.8 TR8.1
N$3
  Top 0.254: 13.71,31.2 LED3.C 13.45,30.88 15.47,30.88 16.45,31.85 17.42,31.85 18.03,32.46 TR3.1
  Top 0.305: LED3.C 13.37,30.7 13.46,30.61
N$4  (via drill 0.41, 0.61)
  Top 0.305: IC1.4 29.59,41.17 30.29,41.17 R34.1 30.75,41.83 TR1.3
  Top 0.406: R40.2 19.3,4.8 | v29.59,41.91 29.59,41.17 | R39.1 19.3,4.8 | 19.3,4.8 v17.88,4.8
  Route15 0.305: v29.59,41.91 26.67,38.99 22.86,38.99 21.08,37.21 21.08,28.07 16.38,23.37 16.38,6.3 v17.88,4.8
N$5
  Top 0.406: L1.1 5.03,18.72 USB1.P$8 USB1.S4 USB1.P$7 | USB1.S3 USB1.P$1 | USB1.P$4 1.5,25.53 USB1.S1 USB1.S5 | USB1.S6 USB1.S2 | USB1.P$5 1.5,18.92 USB1.S2 | USB1.S2 1.25,18.72 USB1.P$6
  Bottom 0.406: USB1.P$2 USB1.P$1 3.46,25.53 1.91,25.53 USB1.P$4 USB1.P$3 1.2,19.23 USB1.P$5 1.77,18.66 3.51,18.66 4.14,19.29 USB1.P$8
N$7  (via drill 0.41)
  Top 0.305: 26.42,42.42 26.42,42.8 26.84,43.23 R11.1 26.93,43.56 R10.1 26.61,45.16 v25.96,45.16 | 26.42,42.42 26.42,41.91 26.55,41.77 IC1.2 | IC1.1 26.9,42.42 26.42,42.42 | USB2.4 5.57,37.45 v5.71,37.47
  Route2 0.305: v5.71,37.47 5.71,38.1 6.73,39.12 16.38,39.12 16.76,39.5 16.76,45.47 17.27,45.97 25.15,45.97 v25.96,45.16
N$8
  Top 1.016: D1.C L5.1
N$9
  Top 0.203: IC4.9 43.63,13.64 43.56,13.72
  Top 0.406: 43.56,13.72 43.56,14.61 R35.1
N$10
  Top 0.254: C21.1 58.32,29.46 L6.1
  Top 0.305: IC2.6 57,30.79 C21.1
N$11
  Top 0.203: 42.62,12.9 IC4.10
  Top 0.406: 42.62,12.9 42.11,12.9 R36.1 R37.2
N$15
  Top 0.406: 1.36,37.38 1.56,37.82 USB2.P$2 1.25,37.62 2.02,36.85 2.02,36.59 2.47,36.14 2.47,33.93 2.67,33.93 | USB2.P$4 USB2.S3 USB2.P$3 USB2.P$1 | USB2.P$8 USB2.P$9 4.2,40.45 USB2.S1 | USB2.P$11 USB2.P$10 4.24,34.52 4.24,35.66 4.21,35.66 USB2.S2 | USB2.P$7 USB2.S4 USB2.P$6 USB2.P$5 | L7.1 3.64,33.58 3.64,33.93
  Top 0.61: USB2.P$5 2.67,33.93 3.64,33.93 4.22,34.52 4.21,35.66
  Bottom 0.406: 2.87,40.44 1.89,39.45 1.89,36.79 2.34,36.34 2.34,34.66 USB2.P$5 | 2.87,40.44 4.08,40.44 USB2.P$9 | USB2.P$1 2.12,42.27 2.54,41.86 2.54,40.77 2.87,40.44
N$16
  Top 0.61: R17.2 18.05,14.67 TR2.3 15.64,14.67 14.96,13.99 14.13,13.99 R16.1
N$18
  Top 0.127: IC3.B9 26.32,28.27 26.32,27.69 26,27.36 25.88,27.36
  Top 0.203: 25.88,27.36 24.83,27.36 24.11,26.65 23.92,26.65 22.9,25.63 R18.2 23.08,25.61
N$19
  Top 0.127: IC3.B8 27.62,28.27 27.62,26.98
  Top 0.203: 27.62,26.98 27.43,26.78 27.43,25.79 R19.2
N$20
  Top 0.254: LED1.A 11.31,32.68 11.31,33.22 11.83,33.73 14.95,33.73 15.29,33.4 R15.3
N$21
  Top 0.254: LED2.A 11.27,35.32 11.57,35.62 15.02,35.62 R15.1
N$22
  Top 0.254: LED3.A 11.27,31.55 11.51,31.85 14.56,31.85 15.31,32.6 R15.4
N$23
  Top 0.127: IC3.C7 28.27,28.93 28.27,27.36
  Top 0.203: 25.22,22.18 C25.1 26.12,23.2 27.75,23.2 28.54,23.98 28.54,26.78 28.27,27.04 28.27,27.36
  Top 0.254: C25.1 R20.2
N$24
  Top 0.152: IC3.A6 28.6,27.82 28.86,27.56 28.86,27.04 28.99,26.91
  Top 0.254: 28.99,26.91 28.99,23.34 29.51,22.82 29.51,21.32 28.66,20.48 28.24,20.48 X3.1 28.04,20.34 C41.1
N$25
  Top 0.152: 29.25,27.89 IC3.A5 29.25,27.23 29.45,27.04 29.45,26.91
  Top 0.254: 29.45,26.91 29.45,23.66 30.16,22.95 30.16,22.63 X3.3 31.88,22.16 C40.1
N$26
  Top 0.152: IC3.E10 25.68,30.55 25.61,30.61
  Top 0.203: C38.1 C37.1 | C37.1 23.27,31.73 | 25.61,30.61 24.64,30.61 23.79,31.46 23.23,31.46 C37.1
N$27
  Top 0.127: 28.27,34.12 28.27,33.48
  Top 0.152: 28.27,33.48 IC3.J6
  Top 0.203: 28.27,34.12 28.27,34.77
  Top 0.254: 28.27,34.77 28.02,35.03
  Top 0.305: 28.02,35.03 28.02,35.36 | C39.1 28.02,35.45 28.02,35.36 | 28.02,35.36 26.98,36.4 26.98,38.21 L8.2
N$34  (via drill 0.41)
  Top 0.152: IC3.K2 31.2,33.99 31.46,34.26 32.76,34.26
  Top 0.203: 32.76,34.26 32.89,34.38 v33.09,34.49
  Top 0.254: R22.1 40.22,33.23 v39.52,33.93
  Bottom 0.254: v33.09,34.49 38.86,34.49 39.45,33.87 v39.52,33.93
N$37  (via drill 0.41)
  Top 0.152: IC3.K3 30.55,33.99 31.16,34.61 32.14,34.61 32.7,35.16 33.02,35.16 33.34,35.49 v33.28,35.49
  Top 0.254: R23.1 40.75,37.7 39.45,36.4 v39.45,35.1
  Bottom 0.254: v33.28,35.49 33.34,35.49 33.41,35.42 39.13,35.42 v39.45,35.1
N$38  (via drill 0.41)
  Top 0.127: 30.23,33.48 30.23,34.19 30.29,34.26
  Top 0.152: IC3.J4 30.23,33.48 | 30.29,34.26 31,34.97 31.52,34.97 v31.98,35.42
  Top 0.254: R24.1 41.12,36.24 v40.49,35.69
  Bottom 0.254: v40.49,35.69 40.43,35.69 40.04,36.08 33.93,36.08 33.73,36.27 32.83,36.27 v31.98,35.42
N$39  (via drill 0.41)
  Top 0.152: IC3.G5 29.25,31.84 29.57,31.52 32.79,31.52 33.02,31.75
  Top 0.254: v40.49,34.52 41.45,34.52 R25.1 | 33.02,31.75 33.53,32.26 33.53,33.34 v33.4,33.47
  Bottom 0.254: v33.4,33.47 33.59,33.28 38.28,33.28 38.55,33.02 40.04,33.02 40.49,33.48 v40.49,34.52
N$40  (via drill 0.2, 0.61)
  Top 0.152: IC3.C9 v26.32,28.93
  Top 0.305: R26.2 59.09,35.31 59.09,35.16 59.22,35.03 60.38,35.03 v60.39,35.05
  Bottom 0.203: v26.32,28.93 26.32,27.36 27.56,26.13 33.67,26.13 35.03,27.5 40.43,27.5 41.66,26.26 53.62,26.26 59.34,31.98 59.34,34 v60.39,35.05
N$41  (via drill 0.41, 0.61)
  Top 0.152: IC3.C10 25.22,29.25 v25.09,29.38
  Top 0.203: 59.11,33.87 R27.2
  Top 0.305: 59.11,33.87 59.11,33.52 59.15,33.48 60.32,33.48 v60.38,33.41
  Bottom 0.203: v25.09,29.38 25.09,27.23 26.59,25.74 33.99,25.74 35.3,27.04 40.17,27.04 41.47,25.74 53.88,25.74 60.38,32.24 v60.38,33.41
N$42  (via drill 0.2 pad 0.41, 0.61)
  Top 0.152: v26.98,29.57 IC3.D8
  Top 0.254: R28.2 43.01,23.66 42.45,23.66 41.73,24.38 v41.73,24.5
  Bottom 0.203: v41.73,24.5 41.34,24.11 35.23,24.11 34.38,24.96 25.74,24.96 22.82,27.89 22.82,30.29 23.07,30.55 25.35,30.55 26.39,29.57 v26.98,29.57
N$43  (via drill 0.41)
  Top 0.127: IC3.F8 26.98,31.52 25.61,31.52 25.41,31.72
  Top 0.203: 25.41,31.72 25.41,31.76 v24.96,32.21 | 46.61,34.58 48.55,32.63 48.55,29.45 45.3,26.2 44.46,26.2 44.07,25.8 44.07,21.44 v44.52,20.98
  Top 0.254: R29.2 45.67,36.62 46.61,35.68 46.61,34.58
  Bottom 0.203: 27.76,20.86 35.46,20.86 35.94,21.34 44.17,21.34 v44.52,20.98
  Bottom 0.254: 27.76,20.86 21.39,27.23 21.39,31.2 22.23,32.05 24.77,32.05 25.13,32.41 v24.96,32.21 | 44.27,20.86 v44.52,20.98
N$44  (via drill 0.2, 0.41)
  Top 0.152: IC3.E9 v26.98,30.23
  Top 0.254: R30.2 46.34,23.59 46.34,21.96 46.41,22.09 v46.47,22.09
  Bottom 0.152: 46.34,22.02 v46.47,22.09
  Bottom 0.203: v26.98,30.23 26.71,30.23 25.93,31 22.68,31 22.36,30.68 22.36,27.69 28.15,21.9 34.85,21.9 35.31,22.35 46.21,22.35
  Bottom 0.254: 46.21,22.35 v46.47,22.09
N$45  (via drill 0.2, 0.41)
  Top 0.152: IC3.F9 v26.98,30.88
  Top 0.254: R31.2 44.98,23.6
  Top 0.305: 44.98,23.6 44.98,22.08 v45.95,21.12
  Bottom 0.203: 45.63,21.38 v45.95,21.12 45.22,21.84 35.56,21.84 35.09,21.38 28.03,21.38 27.89,21.51 21.91,27.5 21.91,31 22.36,31.46 26.39,31.46 v26.98,30.88
N$57  (via drill 0.41)
  Top 0.152: IC3.K9 26.65,34.52 25.8,35.36
  Top 0.203: 25.8,35.36 24.18,35.36 23.92,35.55 23.92,36.59 23.53,37.05 v23.46,37.05
  Bottom 0.152: 19.76,40.3 19.76,41.34 CN1.1
  Bottom 0.254: 19.76,41.34 19.76,39.52 22.23,37.05 v23.46,37.05
N$58  (via drill 0.41)
  Top 0.152: IC3.K8 27.3,35.29 26.66,35.93
  Top 0.203: 27.04,35.55 26.66,35.93 25.61,36.98 v25.61,37.51
  Bottom 0.152: CN1.9
  Bottom 0.254: v25.61,37.51 25.61,40.1 24.83,40.95 24.84,41.65 CN1.9
N$59  (via drill 0.41)
  Top 0.127: 26.85,35.03 26.98,34.9 26.98,33.48 IC3.J8
  Top 0.152: 27.23,33.22 27.3,33.22 IC3.J8 27.23,33.22 | 27.23,33.22 26.98,33.48 | 26.13,35.75 26.85,35.03
  Top 0.203: 26.13,35.75 26.07,35.81 24.7,35.81 24.57,36.01 24.7,36.27 v24.7,36.08
  Bottom 0.152: 21,42.31 CN1.3
  Bottom 0.203: 21,42.31 21.06,42.24
  Bottom 0.254: 21.06,42.24 21.06,39.98 23.01,38.02 23.98,38.02 24.31,37.7 24.31,36.47 v24.7,36.08
N$60  (via drill 0.2)
  Top 0.127: IC3.H7 27.62,32.83 27.62,34.06 27.75,34.19 v27.77,34.52
  Bottom 0.152: CN1.5
  Bottom 0.203: 27.5,34.52 v27.77,34.52
  Bottom 0.254: CN1.5 22.3,40.04 23.73,38.61 24.38,38.61 24.83,38.16 24.83,37.18 27.5,34.52
N$61  (via drill 0.41)
  Top 0.127: 26.32,33.48 26.32,34.19 26,34.52
  Top 0.152: IC3.J9 26.32,33.48 | 26,34.52 25.68,34.77
  Top 0.203: 25.68,34.77 25.55,34.91 24.7,34.91
  Top 0.254: 24.7,34.91 23.46,34.91 23.07,35.3 v23.07,35.95
  Bottom 0.152: CN1.6
  Bottom 0.254: CN1.6 22.3,45.62 21.52,46.41 18.98,46.41 18.27,45.7 18.27,39.91 22.23,35.95 v23.07,35.95
N$67
  Top 0.305: LED6.A 13.39,28.85 R32.1
N$68
  Top 0.305: LED7.A 13.39,26.77 R33.1
PA00_XIN32
  Top 0.254: IC2.1 54.26,28.19 54.73,27.72 54.73,27.04 56.23,25.55 56.23,24.71 Y4.P$2 57.66,23.11 C23.2
PA01_XOUT32
  Top 0.254: 53.56,28.8 53.53,28.8 53.29,28.55 53.29,28.04 54.1,27.23 54.1,26.53 54.09,26.47 53.37,25.87 53.37,24.69 Y4.P$1 52.97,24.16 52.97,23 52.96,22.22 C24.2
  Top 0.305: IC2.2 53.56,28.8
PA02_AIN0
  Top 0.254: TP_A0.X 50.8,4.07 51.8,5 53.82,5 58.89,10.14 58.89,22.75 57.46,24.31 57.46,25.55 55.97,27.11 55.97,28.27 54.89,29.29 IC2.3
PA03_AREFA  (via drill 0.41, 0.61 pad 0.41)
  Top 0.305: v52.42,29.77 52.5,29.79 IC2.4 | 48.33,45.72 C5.+ 48.13,45.52 48.13,44.7 | C4.1 48.68,44.16 48.13,44.7 | 48.13,44.7 45.72,44.7 v40.01,38.99
  Bottom 0.254: 46.15,32.44 48.55,32.44 51.22,29.77
  Bottom 0.305: TP_AREF.X 23.92,50.76 23.92,49.59 26.01,47.5 31.62,47.5 39.88,39.24 v40.01,38.99 40.26,38.86 42.77,36.35 42.77,35.81 46.15,32.44 | 51.22,29.77 v52.42,29.77
PA04_AIN4
  Top 0.254: IC2.9 59.03,32.29 60.45,30.86 60.45,7.87 58.42,5.84 TP_A3.X
  Top 0.305: TP_A3.X 58.37,2.59
PA05_AIN5
  Top 0.254: IC2.10 59.4,32.79 60.96,31.23 60.96,6.81 61.16,6.51 61.16,2.74 TP_A4.X
PA08_TCC0-W0  (via drill 0.61 pad 0.41)
  Top 0.254: IC2.13 52.74,35.58 54.47,37.24 54.5,37.27 55.8,37.27 57.01,38.48 57.01,38.91 v57.3,39.06
  Bottom 0.305: TP_2.X 58.3,50.69 58.3,40.01 v57.3,39.06
PA09_TCC0-W1  (via drill 0.61 pad 0.41)
  Top 0.254: IC2.14 52.24,35.79 54.73,38.28
  Top 0.305: 54.73,38.28 v55.54,39.06
  Bottom 0.305: TP_3.X 55.9,50.78 55.9,38.91 v55.54,39.06
PA10_TCC0-W2  (via drill 0.61 pad 0.41)
  Top 0.254: IC2.15 51.74,36.01 54.34,38.61 54.34,39.65 54.86,40.17 58.11,40.17 58.79,39.49 v59.12,39.06
  Bottom 0.305: TP_1.X 60.91,50.74 60.91,40.85 v59.12,39.06
PA11_TCC0-W3  (via drill 0.41)
  Top 0.305: IC2.16 51.24,34.43 v51.61,34.12
  Bottom 0.305: TP_0.X 63.57,50.73 63.57,41.27 59.09,36.79 54.73,36.79 54.21,36.27 52,34.12 v51.61,34.12
PA14_TCC0-W4  (via drill 0.61)
  Top 0.254: IC2.23 47.74,34.36 49.27,32.83 51.35,32.83 53.49,34.97 53.49,35.49 54.73,36.73 57.07,36.73 v58.17,37.83
  Bottom 0.305: TP_4.X 53.34,48.77 54.15,47.97 54.15,38.67 54.92,37.9 58.11,37.9 v58.17,37.83
PA15_TCC0-W5
  Top 0.254: IC2.24 47.22,35.33 47.22,35.98 46.54,36.66 46.54,39.05 50.16,42.67 52.2,42.67 53.47,43.94 53.47,46.86 50.8,49.53 TP_5.X
PA20_TCC0-W6
  Top 0.254: IC2.29 43.55,31.79 43.16,32.17 40.04,32.17 38.64,33.57 38.64,39.81 48.23,49.4 48.23,50.77 TP_6.X
PA27_TX_LED  (via drill 0.41)
  Top 0.203: IC2.39 48.23,26.13 47.26,25.16 47.26,20.86 v46.41,20.02
  Top 0.305: LED1.C 13.64,32.96 v14.56,32.95
  Bottom 0.305: v14.56,32.95 14.56,30.09 15.93,28.73 15.93,21.48 18.1,19.3 18.67,19.3 45.69,19.3 v46.41,20.02
PA28_USB_HOST_EN  (via drill 0.41)
  Top 0.254: IC2.41 49.24,27.92 48.88,28.27 48.88,28.93 49.2,29.25 49.2,29.32 v49.27,29.39
  Top 0.406: R11.2 29.33,43.4 v29.69,43.76
  Bottom 0.254: v49.27,29.39 49.27,30.68 48.1,31.85 46.6,31.85
  Bottom 0.305: v29.69,43.76 29.74,43.68 34.51,43.68 38.86,39.33 38.86,38.35 39.37,37.85 40.39,37.85 41.99,36.24 41.99,35.62 45.76,31.85 46.6,31.85
PA30_SWCLK
  Top 0.203: 51.52,19.91 R3.1 51.24,20.82 IC2.45
PA31_SWDIO
  Top 0.203: IC2.46 51.74,23.66 51.74,23.65 51.74,21.58 52.55,20.77 52.55,19.55 51.92,18.93 R2.2
PB02_AIN10
  Top 0.254: 63.38,2.67 63.38,5.85 61.47,7.76 61.47,35.54 60.91,36.14 54.93,36.14 54.21,35.42 54.21,34.77 51.39,31.89 51.39,29.08 52.24,28.23 IC2.47
  Top 0.305: TP_A5.X 63.38,2.67
PB03_RX_LED  (via drill 0.41, 0.61)
  Top 0.203: IC2.48 52.74,26.02 52.2,25.48 52.2,21.77 52.65,21.32 54.86,21.32 v56.42,19.76
  Top 0.305: v14.56,34.58 13.4,34.58 LED2.C
  Bottom 0.305: 14.59,34.54 v14.56,34.58 13.65,33.67 13.65,29.96 15.21,28.41 15.21,21.15 17.69,18.67 53.34,18.67 53.72,18.29 55.47,18.29 56.42,19.24 v56.42,19.76
PB08_AIN2
  Top 0.254: IC2.7 58.59,31.29 59.44,30.44 59.44,9.65 53.44,3.65 53.44,2.64 TP_A1.X
  Top 0.305: TP_A1.X 53.37,2.56
PB09_AIN3
  Top 0.254: IC2.8 58.74,31.79 59.94,30.59 59.94,8.43 55.93,4.42 55.93,2.59 TP_A2.X
  Top 0.305: IC2.8
PB10_S4_SPI_MOSI
  Top 0.254: ICSP.4 64.88,26.65 62.92,26.65 61.98,27.59 61.98,38.64 59.54,41.08 51.03,41.08 49.34,39.39 49.34,37.18 49.74,36.78 IC2.19
  Bottom 0.406: 66.18,27.83 ICSP.4
PB11_S4_SPI_SCK
  Top 0.254: ICSP.3 62.47,29.04 62.47,38.94 59.8,41.6 50.77,41.6 48.81,39.65 48.81,36.85 49.24,36.43 IC2.20
PB12_S4_SPI_MISO
  Top 0.254: ICSP.1 62.98,30.49 62.98,39.26 60.06,42.19 50.51,42.19 48.3,39.98 48.3,36.66 48.74,36.22 IC2.21
POWER_LED_CTRL  (via drill 0.41)
  Top 0.152: IC3.K4 29.9,34.34 31.26,35.7
  Top 0.203: TR7.3 19.93,28.49 v19.24,29.25 | 31.26,35.7 31.26,36.13 v31.46,36.34
  Top 0.305: 19.05,29.25 v19.24,29.25
  Bottom 0.203: v31.46,36.34 31,35.81 29.77,34.58 28.8,34.58 28.21,33.99 27.23,33.99 26.07,35.16 20.28,35.16 18.91,33.8 18.91,29.57 v19.24,29.25
PWRIN
  Top 0.406: R39.2 17.75,7.11 D1.A
  Top 1.016: TVS1.K 11.6,13.8 13.34,12.06 13.97,12.06 R16.2 13.97,12.06 13.97,10.92 16.83,8.06 D1.A
  Top 1.422: TVS1.K 11.6,8.39 X1.2
  Route2 0.406: 13.77,7.95 12.66,8.31 X1.2
  Route2 0.813: X1.2 11.7,8.32 14.43,8.32 14.88,7.87 | 36.59,7.87 37.05,7.41 45.76,7.41
  Bottom 0.813: TP_PWRIN.X 13.16,8.31 X1.2
  pour Route2 (isolate 0.254, rank 3): -4.18,15.14 -4.18,-2.09 47.52,-2.09 47.52,8.88 17.75,8.88 17.75,15.14
RESET  (via drill 0.61)
  Top 0.305: ICSP.5 62.08,23.85 62.08,14.56 62.4,14.23 65,14.23 65.53,14.77 CN2.10 | R4.2 49.7,16.34 v49.78,16.64
  Top 0.406: RESET.4 v8.89,47.14 8.96,47.17 8.52,46.86 3.68,46.86 2.88,47.66 RESET.3 2.02,47.02 | R1.1 21.23,5.32 R38.2 21.97,5.33 22.88,6.24 D2.A
  Top 0.61: TP_RESET.X 33.02,4.22 30.94,6.3 23.2,6.3 D2.A
  Bottom 0.406: 33.02,3.51 33.02,3.96 31.39,5.59 27.01,5.59 13.2,19.41 13.2,27.66 8.38,32.48 8.38,46.63 v8.89,47.14 | TP_RESET.X 33.02,3.51 | CN2.10 65.58,15.41 65.58,13.97 64.82,13.21 59.18,13.21 56.06,16.33 50.14,16.33 49.84,16.38 v49.78,16.64 47.72,14.57 44.09,14.57 34,4.49 33.99,4.49 33.02,3.51
RXD
  Top 0.203: IC2.38 47.74,26.22 47.06,25.55 46.52,25.55 R30.1
SCK  (via drill 0.41)
  Top 0.254: IC2.26 45.1,33.29 44.85,33.54 44.85,35.36 v44.46,35.75 | TR3.3 20.01,31.52 18.46,31.52 17.94,31 v17.36,31
  Top 0.305: R24.2 43.34,36.27 43.81,36.27 44.33,35.75 v44.46,35.75
  Bottom 0.305: 44.13,35.88 44.2,35.88 44.27,35.81 44.4,35.81 v44.46,35.75 44.33,35.75 43.98,36.1 43.91,36.1 42.67,37.34 42.67,37.72 31.84,48.55 29.77,48.55 29.05,49.27 29.05,50.7 TP_SCK.X 28.99,50.83 28.99,52.13 28.54,52.59 18.39,52.59 17.61,51.8 17.61,48.95 16.7,48.03 12.09,48.03 10.92,46.86 10.92,40.23 17.36,33.8 v17.36,31
SCL  (via drill 0.2, 0.41)
  Top 0.152: IC3.F7 v27.62,31.52
  Top 0.203: v47.32,30.09 47.12,30.29 IC2.32 42.71,30.29 42.38,30.61
  Top 0.254: TP_SCL.X 18.8,50.01 21.61,47.19 31.91,47.19 36.98,42.12 36.98,32.76 39.13,30.61 42.38,30.61
  Top 0.305: R12.1 16.82,46.09 17.23,46.09 18.33,47.19 18.33,49.34 18.8,49.8 18.8,50.01
  Bottom 0.203: v27.62,31.52 28.14,31.52 28.65,32.03 29.44,32.03 30.1,31.37 32.97,31.37 33.62,32.02 37.73,32.02 38.61,31.14 43.94,31.14 44.59,30.48 46.93,30.48 v47.32,30.09
SDA  (via drill 0.2, 0.41)
  Top 0.152: IC3.G7 v27.62,32.17
  Top 0.203: v47.32,31.14 46.93,30.75 45.76,30.75 IC2.31 45.69,30.81
  Top 0.254: TP_SDA.X 21.29,50.75 21.29,49.34 22.77,47.85 32.16,47.85 37.57,42.45 37.57,33.02 39.45,31.14 42.64,31.14 42.97,30.81 45.69,30.81
  Top 0.305: R13.1 17.42,47.85 17.42,51.74 18,52.33 20.34,52.33 21.34,51.33 TP_SDA.X
  Bottom 0.203: v27.62,32.17 28.11,32.17 28.35,32.41 29.82,32.41 30.48,31.75 32.74,31.75 33.5,32.51 37.95,32.51 38.87,31.59 44.27,31.59 44.85,31 47.19,31 v47.32,31.14
SS  (via drill 0.41 pad 0.41)
  Top 0.254: IC2.27 44.89,32.79 44.33,33.34 44.33,33.78 R25.2 42.58,35.7 42.58,38.61 43.16,39.2 v44.54,39.2
  Top 0.305: R25.2 43.27,34.77
  Bottom 0.254: 36.53,50.75 TP_10.X
  Bottom 0.305: TP_10.X 36.53,50.8 36.53,46.8 44.13,39.2 v44.54,39.2 44.33,39.2
STATUS_LED_CTRL  (via drill 0.41)
  Top 0.127: 32.56,31.2 IC3.F1 33.19,31.2
  Top 0.203: 33.19,31.2 v33.76,31.13
  Top 0.305: TR8.3 21.04,25.07 v21.06,25.16
  Bottom 0.127: 27.04,31.46 27.56,30.94
  Bottom 0.203: 27.04,31.46 25.55,32.95 24.44,32.95 24.05,32.56 21.91,32.56 20.8,31.46 20.8,25.55 v21.06,25.16 | 27.56,30.94 28.21,30.29 30.09,30.29 30.79,30.99 33.57,30.99 v33.76,31.13
SW  (via drill 0.61)
  Top 0.406: 31.63,15.3 C17.2 32.21,14.69 v32.83,14.69 | v34.85,10.54 35.36,9.43 35.62,9.16
  Top 0.61: IC5.6 28.58,10.64 28.54,10.6
  Bottom 0.61: v32.83,14.69 34.85,12.66 v34.85,10.54
  pour Top: 23.98,11.3 35.12,11.3 35.12,12.19 39.5,12.19 40.13,11.56 40.13,9.02 39.07,7.9 23.98,7.9
SWCLK  (via drill 0.41)
  Top 0.127: IC3.D6 28.93,30.23 30.75,30.23 30.88,30.09 30.88,29.7 31,29.57 32.18,29.57
  Top 0.203: v34.51,23.78 34.06,24.3 34.06,27.63 32.18,29.57
  Top 0.305: v54.41,20.41 53.65,20.41 R3.2
  Bottom 0.254: 65.57,19.3 CN2.4 67.17,19.27 67.67,19.76 67.67,21.52 66.5,22.68 55.9,22.68 54.41,21.19 | 54.47,20.34 v54.41,20.41 54.41,21.19 | v34.51,23.78 34.83,23.46 52.23,23.46 54.41,21.29 54.41,21.19
SWDIO  (via drill 0.41)
  Top 0.127: IC3.C5 29.57,28.93 32.17,28.93
  Top 0.203: 32.17,28.93 33.54,27.56 33.54,23.99 33.71,23.82 33.71,23.1 v34.06,22.75
  Top 0.254: R2.1 53.37,18.79
  Top 0.305: v54.47,19.18 53.8,19.18 R2.1
  Bottom 0.254: CN2.2 65.58,20.59 65.58,21.52 64.94,22.16 56.35,22.16 55.31,21.12 55.31,19.95 v54.47,19.18 53.43,20.21 53.43,21.39 51.87,22.95 34.91,22.95 34.71,22.75 v34.06,22.75
TARGET_RESET_EDBG  (via drill 0.41)
  Top 0.127: IC3.B4 30.23,28.27 32.17,28.27
  Top 0.152: 32.17,28.27 32.7,27.75 v32.7,27.04
  Top 0.203: v48.16,27.95 48.74,27.38 IC2.40 48.74,25.92 47.77,24.96 47.77,20.3 C8.1 47.88,20.07 47.75,19.94 47.75,18.98 R4.1
  Top 0.305: 47.77,19.09 R4.1
  Bottom 0.254: v48.16,27.95 47.12,27.95 45.76,29.32 35.95,29.32 33.67,27.04 v32.7,27.04
TARGET_RESET_SENSE  (via drill 0.41, 0.51)
  Top 0.152: IC3.H2 31.23,32.5 31.55,32.82 32.56,32.82 v32.66,32.72
  Top 0.406: R38.1 21.21,7.21 v20.24,8.18
  Route15 0.305: v32.66,32.72 32.66,32.03 31.37,30.73 31.37,21.46 22.73,12.83 22.73,9.14 21.77,8.18 v20.24,8.18
TARGET_USB_N
  Top 0.203: 7.15,38.64 14.49,38.64 arc34 16.9,39.39 arc-31 18.27,39.84 32.95,39.84 arc-92 35.5,37.18 35.5,33.24 arc90 38.56,29.74 45.7,29.74 45.71,29.74 IC2.33 | 7.15,38.64 4.58,38.64 USB2.2 | Z6.1 7.15,39.77 7.15,38.64
TARGET_USB_P
  Top 0.203: 19.28,39.39 19.82,39.39 | 19.82,39.39 32.95,39.39 arc-90 35.03,36.98 35.03,32.93 arc90 38.81,29.33 45.7,29.33 IC2.34 | 7.15,38.22 14.62,38.22 arc36 17.23,39.06 arc-30 18.07,39.39 19.82,39.39 | 7.15,38.22 4.6,38.22 USB2.3 | Z5.1 7.15,37.19 7.15,38.22
TXD
  Top 0.203: IC2.37 47.22,26.78 46.55,26.78 45.16,25.39 R31.1
USBVCC
  Top 0.254: 15.15,44.07 14.94,43.87 14.49,44.06
  Top 0.406: 17.32,44.3 18.98,45.95 30.78,45.95 TR1.1 | 17.32,44.3 17.09,44.07 | 15.15,44.07 15.14,44.07 | R14.2 17.67,43.95 17.32,44.3
  Top 0.61: 17.09,44.07 15.15,44.07 14.93,44.07 C27.+
  Top 0.813: F2.1 12.38,43.91 12.41,43.88 11.52,43.88 C35.+ 14.49,44.06 14.49,43.87 C27.+
VCC_EDBG_3V3  (via drill 0.2 pad 0.41, 0.41, 0.41 pad 0.61, 0.61)
  Top 0.127: IC3.F6 v28.93,31.52 | IC3.E5 v29.57,30.88 | IC3.B6 IC3.B5 29.57,28.27 29.57,27.5 29.64,27.43 | IC3.F2 31.52,30.88 | 28.93,33.48 28.93,34.26
  Top 0.152: 31.52,30.88 32.3,30.88 32.5,30.68 32.56,30.68 | IC3.J5 28.93,33.48 | IC3.D10 25.74,29.9 25.48,30.09 24.31,30.09 v24.05,29.84
  Top 0.203: 29.64,27.43 v30.23,26.84 | IC3.D9 IC3.D10 | C36.1 C34.1 23.31,30.51 v24.05,29.84 | 32.56,30.68 33.23,30.68 34.01,29.9 v34.19,29.7
  Top 0.254: 21.17,30.17 C36.1 | C29.1 30.75,26.32 v30.23,26.84 | 28.93,38.03 L8.1 | 28.93,38.03 28.21,37.09 C31.1 28.93,36.06 28.93,34.26 | 28.93,38.03 28.99,38.03 29.51,38.28 v30.42,38.28 | 35.17,28.4 C30.1 C32.1
  Top 0.305: C30.1 v34.19,29.7 | C33.1 C29.1 | R33.2 R32.2 16.79,27.87 16.84,27.82 v17.28,27.82
  Top 0.813: R21.2 35.8,25.12 v35.63,25.15
  pour Route2 (isolate 0.254): 17.02,39.88 17.03,39.88 17.03,45.7 26.39,45.7 26.39,39.91 36.01,39.88 36.01,19.05 17.02,19.05
VCC_EDBG_USB  (via drill 0.61, 0.76)
  Top 0.152: IC3.A10 25.35,27.95
  Top 0.203: 25.35,27.95 24.5,27.95
  Top 0.305: 21.91,24.7 21.91,26.2 22.95,27.23 23.79,27.23 24.5,27.95
  Top 0.406: 21.91,24.7 21.39,24.18 11.12,24.18 9.49,25.8 9.23,25.8 C28.1
  Top 0.61: F3.1 7.21,29.94 9.04,28.12 v9.04,27.79 9.23,27.59 9.23,25.8 | v12.14,17.13 13.25,17.13 TR2.1
  Bottom 0.61: v9.04,27.79 9.04,18.39 10.3,17.13 v12.14,17.13
VDDCORE
  Top 0.254: IC2.43 50.24,25.6 49.53,24.89 49.53,23.54 C19.1
VIN_SW
  Top 0.61: 27.56,10.92 27.63,10.99 IC5.5 | R5.1 24.07,10.45 C16.+ | 21.85,10.43 19.94,10.43 L5.2
  Top 0.813: 24.95,10.52 25.02,10.6 | 25.02,10.6 24.6,10.6 C16.+ | 25.02,10.6 27.23,10.6 27.56,10.92 | 21.85,10.43 R5.1
XUSB
  Top 0.406: USB2.1 5.34,39.4 5.72,39.78 5.72,41.66 5.2,42.19 5.2,43.85 F2.2
  Top 0.61: C26.1 5.19,44.8 5.33,44.66 5.33,43.98 F2.2
XVCC
  Top 0.406: F3.2 arc-90 3.83,30.13 3.83,27.5 5.53,25.8 5.53,23.98 5.09,23.55 USB1.P1

## Text on the board
Bottom: ZERO PRO V4
tPlace: 13 | 12 | 11 | 10 | 9 | 8 | 7 | 6 | 5 | 4 | 3 | 2 | 1 | 0
tNames: SCL | SDA | AREF | GND | # | # | # | # | # | # | DIGITAL | [#=PWM] | TX | RX | 1 | ANALOG IN | IOREF | RESET | 3V3 | 5V | GND | VIN | A0 | A1 | A2 | A3 | A4 | A5
bNames: designed by | MADE IN | tinker it | ITALY
ReferenceLC: ON
214bmp: D:/SmartProjects/Snc/a4_bn_logo2.bmp